# EAGLE design littleWire-PTH_turned (EAGLE 6.1)
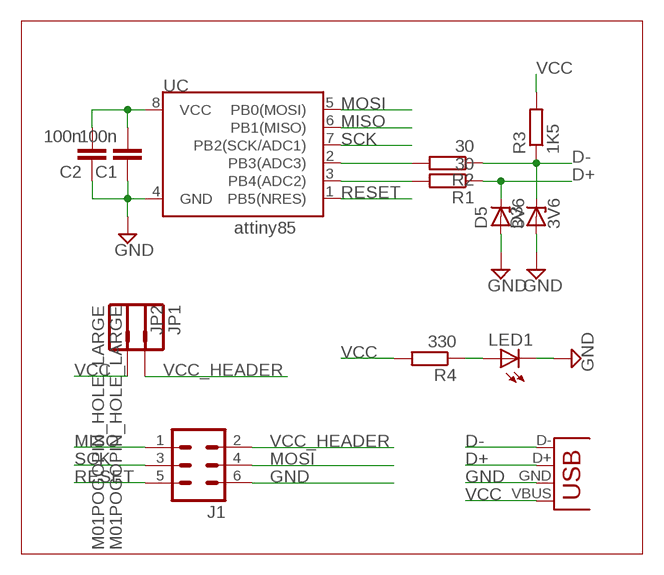
[diagram p0: schematic, sheet 1]

## Parts
C1  100n  C-EU025-025X050  [C025-025X050]
C2  100n  C-EU025-025X050  [C025-025X050]
D3  3V6  ZENER-DIODEZD-2.5  [ZDIO-2.5]
D5  3V6  ZENER-DIODEZD-7.5  [ZDIO-7.5]
J1  ML6  [ML6]
JP1  M01POGOPIN_HOLE_LARGE  [1X01_POGOPIN_HOLE_LARGE]
JP2  M01POGOPIN_HOLE_LARGE  [1X01_POGOPIN_HOLE_LARGE]
LED1  LED3MM  [LED3MM]
R1  30  R-EU_0207/2V  [0207/2V]
R2  30  R-EU_0207/2V  [0207/2V]
R3  1K5  R-EU_0207/2V  [0207/2V]
R4  330  R-EU_0207/2V  [0207/2V]
UC  ATTINY45DIP8  [DIP08]
X1  USB-A-H  [USB-A-H]

## Nets
D+: D5.C R1.1 X1.D+(D-)
D-: D3.C R2.1 R3.1 X1.D-(D+)
GND: C1.1 C2.1 D3.A D5.A J1.6 LED1.K(C) UC.4(GND) X1.GND(VBUS)
MISO: J1.1 UC.6(PB1(MISO))
MOSI: J1.4 UC.5(PB0(MOSI))
N$1: R2.2 UC.2(PB3(ADC3))
N$2: R1.2 UC.3(PB4(ADC2))
N$3: LED1.A R4.1
RESET: J1.5 UC.1(PB5(NRES))
SCK: J1.3 UC.7(PB2(SCK/ADC1))
VCC: C1.2 C2.2 JP2.1 R3.2 R4.2 UC.8(VCC) X1.VBUS(GND)
VCC_HEADER: J1.2 JP1.1

## Notes on the sheet
- attiny85

## Library data of the parts
C1 C2 = rcl:C-EU: CAPACITOR, European symbol
D3 D5 = diode:ZENER-DIODE: Z-Diode
J1 = con-ml:ML6: HARTING; OC_FARNELL: unknown; OC_NEWARK: unknown
JP1 JP2 = SparkFun-Connectors:M01: Header 1 Standard 1-pin 0.1" header. Use with straight break away headers (SKU : PRT-00116), right angle break away headers (PRT-00553), swiss pins (PRT-00743), machine pins (PRT-00117), and female headers (PRT-00115).
LED1 = led:LED: LED OSRAM: - CHIPLED LG R971, LG N971, LY N971, LG Q971, LY Q971, LO R971, LY R971 LH N974, LH R974 LS Q976, LO Q976, LY Q976 LO Q996 - Hyper CHIPLED LW Q18S LB Q993, LB Q99A, LB R99A - SideLED LS A670, LO A670, LY A670, LG A670, LP A670 LB A673, LV A673, LT A673, LW A673 LH A674 LY A675 LS A676, LA A676, LO A676, LY A676, LW A676 LS A679, LY A679, LG A679 - Hyper Micro SIDELED® LS Y876, LA Y876, LO Y876, LY Y876 LT Y87S - SmartLED LW L88C, LW L88S LB L89C, LB L89S, LG L890 LS L89K, LO L89K, LY L89K LS L896, LA L896, LO L896, LY L896 - TOPLED LS T670, LO T670, LY T670, LG T670, LP T670 LSG T670, LSP T670, LSY T670, LOP T670, LYG T670 LG T671, LOG T671, LSG T671 LB T673, LV T673, LT T673, LW T673 LH T674 LS T676, LA T676, LO T676, LY T676, LB T676, LH T676, LSB T676, LW T676 LB T67C, LV T67C, LT T67C, LS T67K, LO T67K, LY T67K, LW E67C LS E67B, LA E67B, LO E67B, LY E67B, LB E67C, LV E67C, LT E67C LW T67C LS T679, LY T679, LG T679 LS T770, LO T770, LY T770, LG T770, LP T770 LB T773, LV T773, LT T773, LW T773 LH T774 LS E675, LA E675, LY E675, LS T675 LS T776, LA T776, LO T776, LY T776, LB T776 LHGB T686 LT T68C, LB T68C - Hyper Mini TOPLED® LB M676 - Mini TOPLED Santana® LG M470 LS M47K, LO M47K, LY M47K Source: http://www.osram.convergy.de LUXEON: - LUMILED® LXK2-PW12-R00, LXK2-PW12-S00, LXK2-PW14-U00, LXK2-PW14-V00 LXK2-PM12-R00, LXK2-PM12-S00, LXK2-PM14-U00 LXK2-PE12-Q00, LXK2-PE12-R00, LXK2-PE12-S00, LXK2-PE14-T00, LXK2-PE14-U00 LXK2-PB12-K00, LXK2-PB12-L00, LXK2-PB12-M00, LXK2-PB14-N00, LXK2-PB14-P00, LXK2-PB14-Q00 LXK2-PR12-L00, LXK2-PR12-M00, LXK2-PR14-Q00, LXK2-PR14-R00 LXK2-PD12-Q00, LXK2-PD12-R00, LXK2-PD12-S00 LXK2-PH12-R00, LXK2-PH12-S00 LXK2-PL12-P00, LXK2-PL12-Q00, LXK2-PL12-R00 Source: www.luxeon.com KINGBRIGHT: KA-3528ASYC Source: www.kingbright.com
R1-R4 = rcl:R-EU_: RESISTOR, European symbol
UC = SparkFun:ATTINY45: Atmel ATTiny45
X1 = SparkFun:USB: USB Connectors USB-B-PTH is fully proven SKU : PRT-00139 USB-miniB is fully proven SKU : PRT-00587 USB-A-PCB is untested. USB-A-H is throughly reviewed, but untested. Spark Fun Electronics SKU : PRT-00437 USB-B-SMT is throughly reviewed, but untested. Needs silkscreen touching up. USB-A-S has not been used/tested USB-MB-H has not been used/tested

## Board
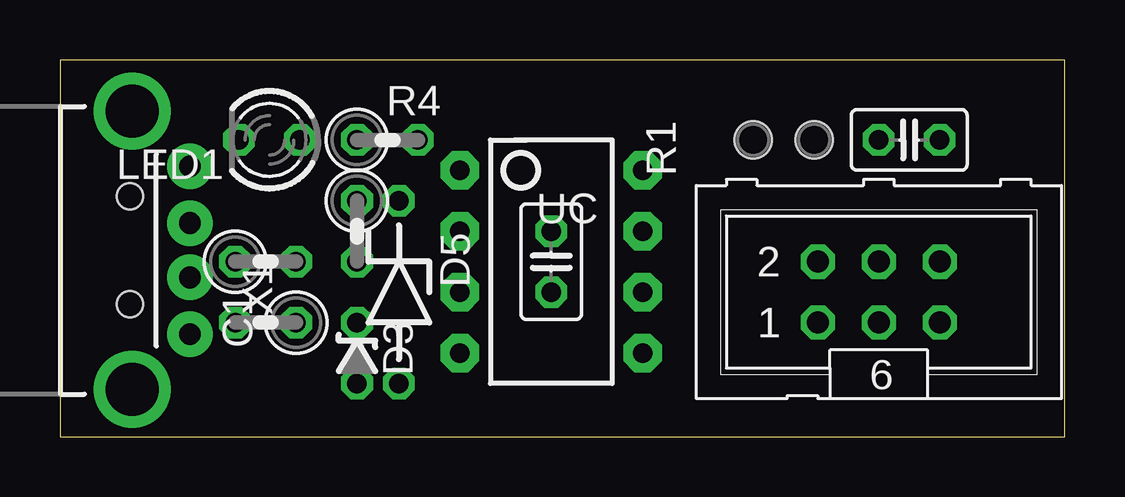
[diagram p1: board, top side]
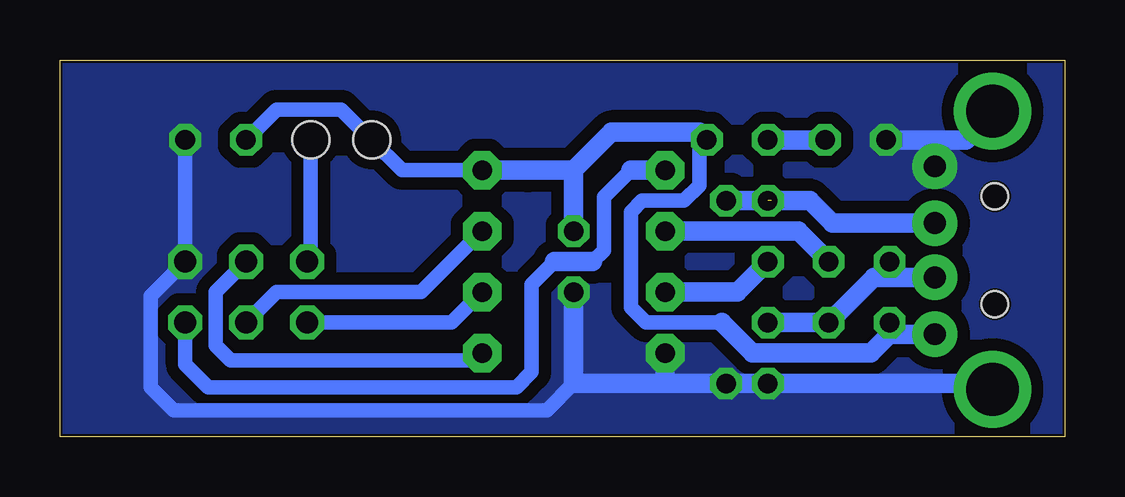
[diagram p2: board, bottom side, seen from below]

Size 41.89 x 15.72 mm. Coordinates in mm from the lower left corner, seen from the top.
Outline: 0,0 41.89,0 41.89,15.7 0,15.72 0,0
Copper layers (1*16): Top 0.035mm / dielectric 1.5mm / Bottom 0.035mm
Design rules: minimum track width 6mil, minimum drill 12mil, track to track 20mil, track to pad 20mil, pad to pad 20mil, via to via 20mil, smd to smd 8mil, copper to edge 4mil, drill to drill 4mil, minimum pad ring 10mil, minimum via ring 6mil, stop-mask expansion 2mil, vias tented up to drill 100mil, thermal gap 10mil

### Footprints (pad centres in the part's own frame; a part is rotated, then mirrored left to right if it is on the bottom)
C025-025X050 = drill 0.813 octagon: 1 -1.27,0; 2 1.27,0
ZDIO-2.5 = drill 0.813 octagon: A 1.27,0; C -1.27,0
ZDIO-7.5 = drill 0.813 octagon: A 3.81,0; C -3.81,0
ML6 = drill 0.914 octagon: 1 -2.54,-1.27; 2 -2.54,1.27; 3 0,-1.27; 4 0,1.27; 5 2.54,-1.27; 6 2.54,1.27
1X01_POGOPIN_HOLE_LARGE = drill 0.9 pad 0.813: 1 0,0 | hole 1.549: 0,0
LED3MM = drill 0.813 octagon: A -1.27,0; K 1.27,0
0207/2V = drill 0.813 octagon: 1 -1.27,0; 2 1.27,0
DIP08 = drill 0.813 pad 1.6 octagon: 1 -3.81,-3.81; 2 -1.27,-3.81; 3 1.27,-3.81; 4 3.81,-3.81; 5 3.81,3.81; 6 1.27,3.81; 7 -1.27,3.81; 8 -3.81,3.81
USB-A-H = drill 0.914 pad 1.88: D+ 2.4,1.127; D- 2.4,-1.127; GND 2.4,3.5; VBUS 2.4,-3.5 | drill 2.2: GND2 0,-5.8; GND3 0,5.8 | hole 1.1: -0.1,2.25; -0.1,-2.25

### Placement (x,y rotation side)
C1  20.48,7.3 90 top
C2  35.4,12.38 180 top
D3  12.38,3.49 270 top
D5  14.13,6.03 270 top
J1  34.13,6.03 0 top
JP1  31.43,12.38 0 top
JP2  28.89,12.38 0 top
LED1  8.73,12.38 180 top
R1  12.38,8.57 270 top
R2  8.57,7.3 0 top
R3  8.57,4.76 180 top
R4  13.65,12.38 0 top
UC  20.48,7.3 270 top
X1  3.02,7.78 0 top

### Tracks (layer width: path | path; a pad name or v marks a point on that pad's centre or on a via)
D+  (1 unrouted)
  Bottom 0.61: 12.22,9.84 12.38,9.68
  Bottom 0.813: D5.C R1.1 | X1.D+ 9.7,8.91 10.64,9.84 12.22,9.84
D-
  Bottom 0.813: D3.C R3.1 7.95,6.65 7.3,6.65 | X1.D- 7.3,6.65 | R2.1 7.3,6.65
GND
  Bottom 0.61: 20.48,2.22 21.59,1.11 37.15,1.11 38.1,2.06 38.1,5.87 J1.6 C2.1
  Bottom 0.813: 16.67,2.22 D5.A D3.A 3.33,2.22 3.02,1.91 | 16.67,2.22 20.48,2.22 C1.1 | UC.4 16.67,2.22 | LED1.K 5.4,12.38 | 5.4,12.38 4.13,12.38 3.02,13.49 | X1.GND 5.42,12.36 5.4,12.38
  pour Bottom (no thermals): 0,0 41.91,0 41.91,15.72 0,15.72
MISO
  Bottom 0.61: UC.6 25.56,4.76 J1.1
MOSI
  Bottom 0.61: UC.5 24.61,3.17 34.77,3.17 35.4,3.81 35.4,6.03 J1.4
N$1
  Bottom 0.61: R2.2
  Bottom 0.813: UC.2 11.11,8.57 R2.2
N$2
  Bottom 0.813: UC.3 13.65,6.03 R1.2
N$3
  Bottom 0.813: LED1.A R4.1
RESET
  Bottom 0.61: 21.27,7.3 22.22,6.35 22.22,2.7 22.86,2.06 35.72,2.06 36.67,3.02 J1.5 | 18.1,11.11 19.21,10 19.21,7.78 19.68,7.3
  Bottom 0.813: UC.1 18.1,11.11 | 19.68,7.3 21.27,7.3
SCK
  Bottom 0.61: UC.7 26.83,6.03 32.86,6.03 J1.3
VCC
  Bottom 0.61: 14.29,4.76 17.46,4.76 18.1,5.4 18.1,9.37 17.62,9.84 15.87,9.84 15.24,10.48 15.24,12.54 15.4,12.7 | 24.13,11.11 27.62,11.11 JP2.1 30.16,13.65 32.86,13.65 C2.2 | 22.38,11.11
  Bottom 0.813: 14.29,4.76 13.02,3.49 8.1,3.49 7.31,4.28 | C1.2 20.48,11.11 | 20.48,11.11 22.38,11.11 24.13,11.11 UC.8 | R4.2 15.24,12.7 15.4,12.7 18.89,12.7 20.48,11.11 | 7.31,4.28 7.3,4.29 R3.2 | X1.VBUS 7.31,4.28
VCC_HEADER
  Bottom 0.61: JP1.1 31.43,7.46 J1.2

### Text on the board
_tsilk: power external board? | 100 nF | open hardware | +5V | mosi | gnd | 27 ohm | 27 ohm | 1.2 kohm | miso | sck | reset | tiny85 | 3.6V zeners | kehribar.me/projects/Little-Wire | 100 nF